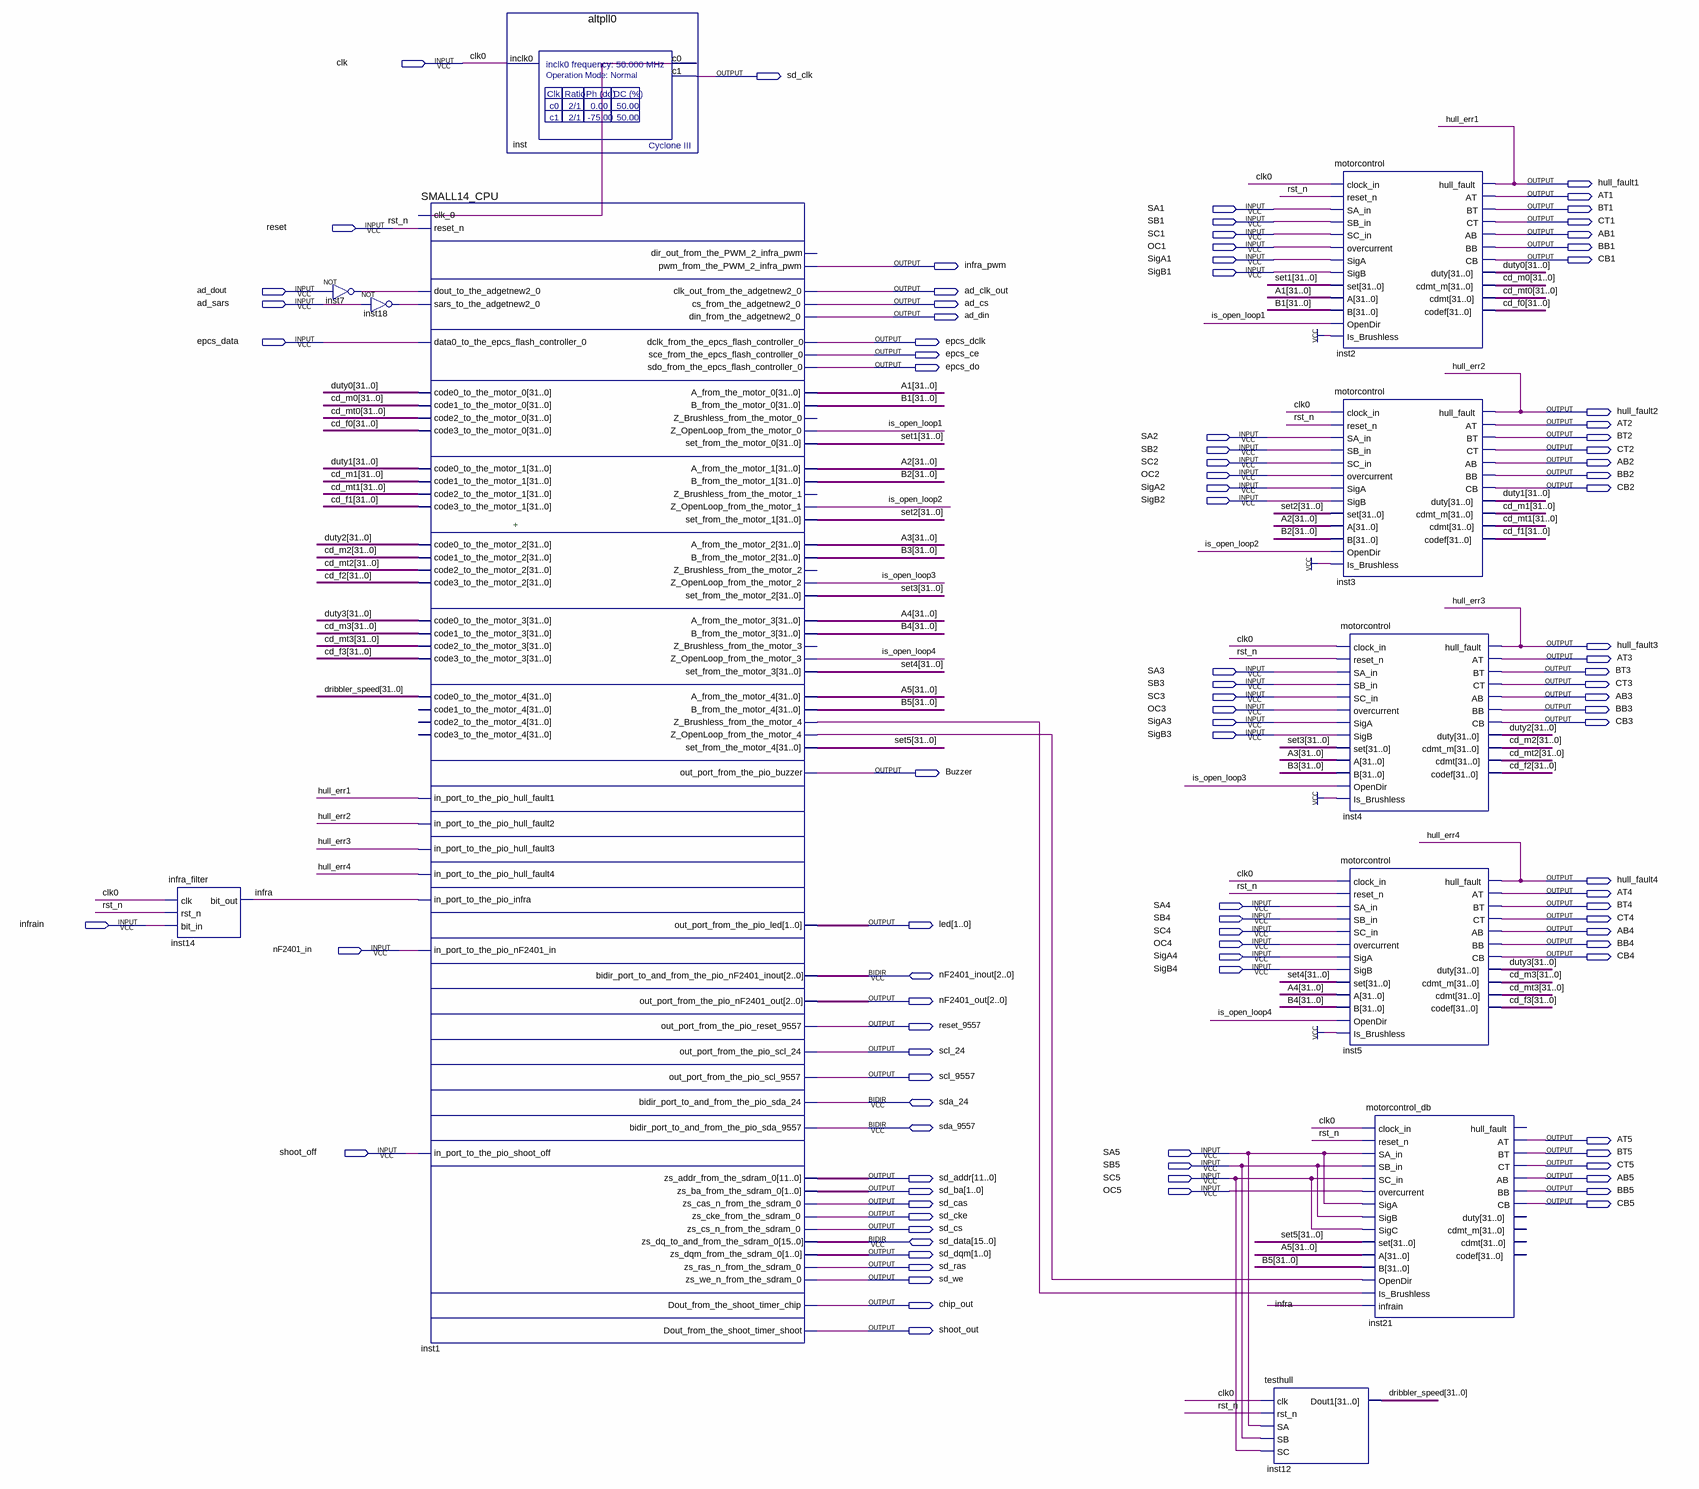
[diagram p0: schematic sheet]
// Quartus schematic SMALL_V14.bdf as structural Verilog: 11 symbols, 98 pins
module SMALL_V14 (
  input  clk,
  input  SA1,
  input  SB1,
  input  reset,
  input  SC1,
  input  OC1,
  input  SigA1,
  input  SigB1,
  input  ad_dout,
  input  ad_sars,
  input  epcs_data,
  input  SA2,
  input  SB2,
  input  SC2,
  input  OC2,
  input  SigA2,
  input  SigB2,
  input  SA3,
  input  SB3,
  input  SC3,
  input  OC3,
  input  SigA3,
  input  SigB3,
  input  SA4,
  input  SB4,
  input  infrain,
  input  SC4,
  input  OC4,
  input  nF2401_in,
  input  SigA4,
  input  SigB4,
  input  shoot_off,
  input  SA5,
  input  SB5,
  input  SC5,
  input  OC5,
  inout  [2:0] nF2401_inout,
  inout  sda_24,
  inout  sda_9557,
  inout  [15:0] sd_data,
  output sd_clk,
  output hull_fault1,
  output AT1,
  output BT1,
  output CT1,
  output AB1,
  output BB1,
  output CB1,
  output infra_pwm,
  output ad_clk_out,
  output ad_cs,
  output ad_din,
  output epcs_dclk,
  output epcs_ce,
  output epcs_do,
  output hull_fault2,
  output AT2,
  output BT2,
  output CT2,
  output AB2,
  output BB2,
  output CB2,
  output hull_fault3,
  output AT3,
  output BT3,
  output CT3,
  output AB3,
  output BB3,
  output CB3,
  output Buzzer,
  output hull_fault4,
  output AT4,
  output BT4,
  output CT4,
  output [1:0] led,
  output AB4,
  output BB4,
  output CB4,
  output [2:0] nF2401_out,
  output reset_9557,
  output scl_24,
  output scl_9557,
  output AT5,
  output BT5,
  output CT5,
  output [11:0] sd_addr,
  output AB5,
  output [1:0] sd_ba,
  output BB5,
  output sd_cas,
  output CB5,
  output sd_cke,
  output sd_cs,
  output [1:0] sd_dqm,
  output sd_ras,
  output sd_we,
  output chip_out,
  output shoot_out
);

  wire infra, inst1_z_brushless_from_the_motor_4, inst1_z_openloop_from_the_motor_4, inst7_out, inst18_out,
       inst_c0, is_open_loop1, is_open_loop2, is_open_loop3, is_open_loop4;
  wire [31:0] A1, A2, A3, A4, A5, B1, B2, B3, B4, B5, cd_f0, cd_f1, cd_f2, cd_f3, cd_m0, cd_m1, cd_m2, cd_m3,
       cd_mt0, cd_mt1, cd_mt2, cd_mt3, dribbler_speed, duty0, duty1, duty2, duty3, set1, set2, set3, set4,
       set5;

  infra_filter inst14 (.clk(clk), .rst_n(reset), .bit_in(infrain), .bit_out(infra));
  not inst7 (inst7_out, ad_dout);
  not inst18 (inst18_out, ad_sars);
  SMALL14_CPU inst1 (
    .clk_0(inst_c0), .reset_n(reset), .dout_to_the_adgetnew2_0(inst7_out),
    .sars_to_the_adgetnew2_0(inst18_out), .data0_to_the_epcs_flash_controller_0(epcs_data),
    .code0_to_the_motor_0(duty0), .code1_to_the_motor_0(cd_m0), .code2_to_the_motor_0(cd_mt0),
    .code3_to_the_motor_0(cd_f0), .code0_to_the_motor_1(duty1), .code1_to_the_motor_1(cd_m1),
    .code2_to_the_motor_1(cd_mt1), .code3_to_the_motor_1(cd_f1), .code0_to_the_motor_2(duty2),
    .code1_to_the_motor_2(cd_m2), .code2_to_the_motor_2(cd_mt2), .code3_to_the_motor_2(cd_f2),
    .code0_to_the_motor_3(duty3), .code1_to_the_motor_3(cd_m3), .code2_to_the_motor_3(cd_mt3),
    .code3_to_the_motor_3(cd_f3), .code0_to_the_motor_4(dribbler_speed),
    .in_port_to_the_pio_hull_fault1(hull_fault1), .in_port_to_the_pio_hull_fault2(hull_fault2),
    .in_port_to_the_pio_hull_fault3(hull_fault3), .in_port_to_the_pio_hull_fault4(hull_fault4),
    .in_port_to_the_pio_infra(infra), .in_port_to_the_pio_nF2401_in(nF2401_in),
    .in_port_to_the_pio_shoot_off(shoot_off), .pwm_from_the_PWM_2_infra_pwm(infra_pwm),
    .clk_out_from_the_adgetnew2_0(ad_clk_out), .cs_from_the_adgetnew2_0(ad_cs),
    .din_from_the_adgetnew2_0(ad_din), .dclk_from_the_epcs_flash_controller_0(epcs_dclk),
    .sce_from_the_epcs_flash_controller_0(epcs_ce), .sdo_from_the_epcs_flash_controller_0(epcs_do),
    .A_from_the_motor_0(A1), .B_from_the_motor_0(B1), .Z_OpenLoop_from_the_motor_0(is_open_loop1),
    .set_from_the_motor_0(set1), .A_from_the_motor_1(A2), .B_from_the_motor_1(B2),
    .Z_OpenLoop_from_the_motor_1(is_open_loop2), .set_from_the_motor_1(set2), .A_from_the_motor_2(A3),
    .B_from_the_motor_2(B3), .Z_OpenLoop_from_the_motor_2(is_open_loop3), .set_from_the_motor_2(set3),
    .A_from_the_motor_3(A4), .B_from_the_motor_3(B4), .Z_OpenLoop_from_the_motor_3(is_open_loop4),
    .set_from_the_motor_3(set4), .A_from_the_motor_4(A5), .B_from_the_motor_4(B5),
    .Z_Brushless_from_the_motor_4(inst1_z_brushless_from_the_motor_4),
    .Z_OpenLoop_from_the_motor_4(inst1_z_openloop_from_the_motor_4), .set_from_the_motor_4(set5),
    .out_port_from_the_pio_buzzer(Buzzer), .out_port_from_the_pio_led(led),
    .out_port_from_the_pio_nF2401_out(nF2401_out), .out_port_from_the_pio_reset_9557(reset_9557),
    .out_port_from_the_pio_scl_24(scl_24), .out_port_from_the_pio_scl_9557(scl_9557),
    .zs_addr_from_the_sdram_0(sd_addr), .zs_ba_from_the_sdram_0(sd_ba), .zs_cas_n_from_the_sdram_0(sd_cas),
    .zs_cke_from_the_sdram_0(sd_cke), .zs_cs_n_from_the_sdram_0(sd_cs), .zs_dqm_from_the_sdram_0(sd_dqm),
    .zs_ras_n_from_the_sdram_0(sd_ras), .zs_we_n_from_the_sdram_0(sd_we),
    .Dout_from_the_shoot_timer_chip(chip_out), .Dout_from_the_shoot_timer_shoot(shoot_out),
    .bidir_port_to_and_from_the_pio_nF2401_inout(nF2401_inout),
    .bidir_port_to_and_from_the_pio_sda_24(sda_24), .bidir_port_to_and_from_the_pio_sda_9557(sda_9557),
    .zs_dq_to_and_from_the_sdram_0(sd_data));  // open: code1_to_the_motor_4, code2_to_the_motor_4, code3_to_the_motor_4, dir_out_from_the_PWM_2_infra_pwm, Z_Brushless_from_the_motor_0, Z_Brushless_from_the_motor_1, Z_Brushless_from_the_motor_2, Z_Brushless_from_the_motor_3
  altpll0 inst (.inclk0(clk), .c0(inst_c0), .c1(sd_clk));
  testhull inst12 (.clk(clk), .rst_n(reset), .SA(SA5), .SB(SB5), .SC(SC5), .Dout1(dribbler_speed));
  motorcontrol inst2 (
    .clock_in(clk), .reset_n(reset), .SA_in(SA1), .SB_in(SB1), .SC_in(SC1), .overcurrent(OC1), .SigA(SigA1),
    .SigB(SigB1), .set(set1), .A(A1), .B(B1), .OpenDir(is_open_loop1), .Is_Brushless(1'b1),
    .hull_fault(hull_fault1), .AT(AT1), .BT(BT1), .CT(CT1), .AB(AB1), .BB(BB1), .CB(CB1), .duty(duty0),
    .cdmt_m(cd_m0), .cdmt(cd_mt0), .codef(cd_f0));
  motorcontrol inst3 (
    .clock_in(clk), .reset_n(reset), .SA_in(SA2), .SB_in(SB2), .SC_in(SC2), .overcurrent(OC2), .SigA(SigA2),
    .SigB(SigB2), .set(set2), .A(A2), .B(B2), .OpenDir(is_open_loop2), .Is_Brushless(1'b1),
    .hull_fault(hull_fault2), .AT(AT2), .BT(BT2), .CT(CT2), .AB(AB2), .BB(BB2), .CB(CB2), .duty(duty1),
    .cdmt_m(cd_m1), .cdmt(cd_mt1), .codef(cd_f1));
  motorcontrol inst4 (
    .clock_in(clk), .reset_n(reset), .SA_in(SA3), .SB_in(SB3), .SC_in(SC3), .overcurrent(OC3), .SigA(SigA3),
    .SigB(SigB3), .set(set3), .A(A3), .B(B3), .OpenDir(is_open_loop3), .Is_Brushless(1'b1),
    .hull_fault(hull_fault3), .AT(AT3), .BT(BT3), .CT(CT3), .AB(AB3), .BB(BB3), .CB(CB3), .duty(duty2),
    .cdmt_m(cd_m2), .cdmt(cd_mt2), .codef(cd_f2));
  motorcontrol inst5 (
    .clock_in(clk), .reset_n(reset), .SA_in(SA4), .SB_in(SB4), .SC_in(SC4), .overcurrent(OC4), .SigA(SigA4),
    .SigB(SigB4), .set(set4), .A(A4), .B(B4), .OpenDir(is_open_loop4), .Is_Brushless(1'b1),
    .hull_fault(hull_fault4), .AT(AT4), .BT(BT4), .CT(CT4), .AB(AB4), .BB(BB4), .CB(CB4), .duty(duty3),
    .cdmt_m(cd_m3), .cdmt(cd_mt3), .codef(cd_f3));
  motorcontrol_db inst21 (
    .clock_in(clk), .reset_n(reset), .SA_in(SA5), .SB_in(SB5), .SC_in(SC5), .overcurrent(OC5), .SigA(SA5),
    .SigB(SB5), .SigC(SC5), .set(set5), .A(A5), .B(B5), .OpenDir(inst1_z_openloop_from_the_motor_4),
    .Is_Brushless(inst1_z_brushless_from_the_motor_4), .infrain(infra), .AT(AT5), .BT(BT5), .CT(CT5),
    .AB(AB5), .BB(BB5), .CB(CB5));  // open: hull_fault, duty, cdmt_m, cdmt, codef

  // Other names for the same wires on the sheet: clk0 = clk; hull_err1 = hull_fault1; hull_err2 = hull_fault2;
  //   hull_err3 = hull_fault3; hull_err4 = hull_fault4; rst_n = reset

  // Notes on the sheet:
  //   +
endmodule
